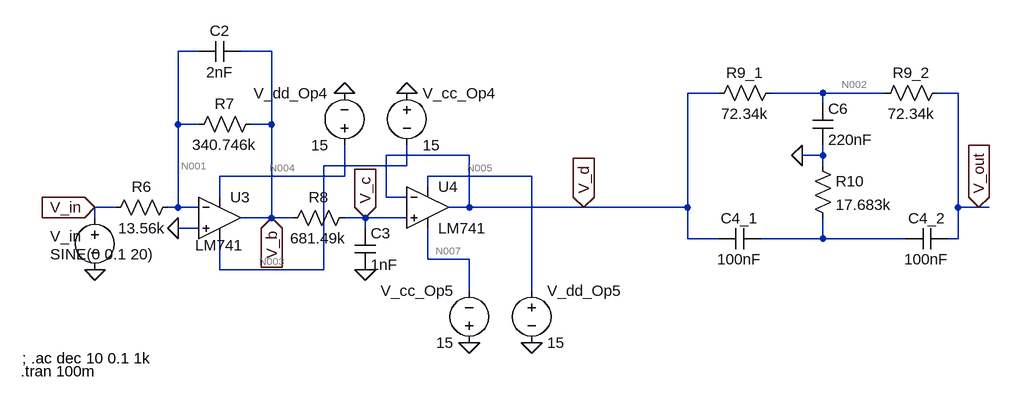
[diagram p0: schematic Experiment_1_c.asc]
Experiment_1_c.asc, the LTspice schematic file:
Version 4
SHEET 1 1132 680
WIRE -160 -48 -192 -48
WIRE -48 -48 -96 -48
WIRE 640 16 592 16
WIRE 800 16 720 16
WIRE 896 16 800 16
WIRE 1008 16 976 16
WIRE 800 32 800 16
WIRE -192 64 -192 -48
WIRE -160 64 -192 64
WIRE -48 64 -48 -48
WIRE -48 64 -80 64
WIRE 256 112 128 112
WIRE 800 112 800 96
WIRE 800 112 768 112
WIRE 160 128 160 96
WIRE 160 128 32 128
WIRE 800 128 800 112
WIRE 64 144 64 96
WIRE 64 144 -128 144
WIRE 352 144 192 144
WIRE 192 160 192 144
WIRE -128 176 -128 144
WIRE 128 176 128 112
WIRE 160 176 128 176
WIRE -288 192 -320 192
WIRE -192 192 -192 64
WIRE -192 192 -208 192
WIRE -160 192 -192 192
WIRE 256 192 256 112
WIRE 256 192 224 192
WIRE 432 192 256 192
WIRE 592 192 592 16
WIRE 592 192 432 192
WIRE 1008 192 1008 16
WIRE 1040 192 1008 192
WIRE 1056 192 1040 192
WIRE -320 208 -320 192
WIRE -48 208 -48 64
WIRE -48 208 -96 208
WIRE -16 208 -48 208
WIRE 96 208 64 208
WIRE 160 208 96 208
WIRE -160 224 -192 224
WIRE 96 224 96 208
WIRE 592 240 592 192
WIRE 640 240 592 240
WIRE 800 240 800 208
WIRE 800 240 704 240
WIRE 928 240 800 240
WIRE 1008 240 1008 192
WIRE 1008 240 992 240
WIRE 192 272 192 224
WIRE 256 272 192 272
WIRE -128 288 -128 240
WIRE 32 288 32 128
WIRE 32 288 -128 288
WIRE 256 320 256 272
WIRE 352 320 352 144
FLAG -320 288 0
FLAG -192 224 0
FLAG 64 16 0
FLAG 160 16 0
FLAG 256 400 0
FLAG 352 400 0
FLAG 96 288 0
FLAG 768 112 0
FLAG 432 192 V_d
IOPIN 432 192 In
FLAG 96 208 V_c
IOPIN 96 208 In
FLAG -48 208 V_b
IOPIN -48 208 In
FLAG -320 192 V_in
IOPIN -320 192 In
FLAG 1040 192 V_out
IOPIN 1040 192 In
SYMBOL res 80 192 R90
WINDOW 0 0 56 VBottom 2
WINDOW 3 32 56 VTop 2
SYMATTR InstName R8
SYMATTR Value 681.49k
SYMBOL cap 80 224 R0
SYMATTR InstName C3
SYMATTR Value 1nF
SYMBOL res -192 176 R90
WINDOW 0 0 56 VBottom 2
WINDOW 3 32 56 VTop 2
SYMATTR InstName R6
SYMATTR Value 13.56k
SYMBOL res -64 48 R90
WINDOW 0 0 56 VBottom 2
WINDOW 3 32 56 VTop 2
SYMATTR InstName R7
SYMATTR Value 340.746k
SYMBOL cap -96 -64 R90
WINDOW 0 0 32 VBottom 2
WINDOW 3 32 32 VTop 2
SYMATTR InstName C2
SYMATTR Value 2nF
SYMBOL voltage -320 192 R0
WINDOW 0 -69 44 Left 2
WINDOW 3 -69 72 Left 2
WINDOW 123 -69 100 Left 2
WINDOW 39 0 0 Left 0
SYMATTR InstName V_in
SYMATTR Value SINE(0 0.1 20)
SYMBOL voltage 64 112 R180
WINDOW 0 24 96 Left 2
WINDOW 3 24 16 Left 2
SYMATTR InstName V_dd_Op4
SYMATTR Value 15
SYMBOL voltage 160 0 R0
WINDOW 123 0 0 Left 0
WINDOW 39 0 0 Left 0
SYMATTR InstName V_cc_Op4
SYMATTR Value 15
SYMBOL voltage 256 416 R180
WINDOW 0 24 96 Left 2
WINDOW 3 24 16 Left 2
WINDOW 123 0 0 Left 0
WINDOW 39 0 0 Left 0
SYMATTR InstName V_cc_Op5
SYMATTR Value 15
SYMBOL voltage 352 304 R0
WINDOW 123 0 0 Left 0
WINDOW 39 0 0 Left 0
SYMATTR InstName V_dd_Op5
SYMATTR Value 15
SYMBOL res 784 112 R0
SYMATTR InstName R10
SYMATTR Value 17.683k
SYMBOL res 736 0 R90
WINDOW 0 0 56 VBottom 2
WINDOW 3 32 56 VTop 2
SYMATTR InstName R9_1
SYMATTR Value 72.34k
SYMBOL res 992 0 R90
WINDOW 0 0 56 VBottom 2
WINDOW 3 32 56 VTop 2
SYMATTR InstName R9_2
SYMATTR Value 72.34k
SYMBOL cap 784 32 R0
SYMATTR InstName C6
SYMATTR Value 220nF
SYMBOL cap 704 224 R90
WINDOW 0 0 32 VBottom 2
WINDOW 3 32 32 VTop 2
SYMATTR InstName C4_1
SYMATTR Value 100nF
SYMBOL cap 992 224 R90
WINDOW 0 0 32 VBottom 2
WINDOW 3 32 32 VTop 2
SYMATTR InstName C4_2
SYMATTR Value 100nF
SYMBOL LM741 -128 144 R0
WINDOW 3 -38 106 Left 2
SYMATTR InstName U3
SYMBOL LM741 192 128 R0
SYMATTR InstName U4
TEXT -432 424 Left 2 !; .ac dec 10 0.1 1k
TEXT -434 444 Left 2 !.tran 100m

The netlist it stands for:
* Experiment_1_c.asc
R8 V_c V_b 681.49k
C3 V_c 0 1nF
R6 N001 V_in 13.56k
R7 V_b N001 340.746k
C2 V_b N001 2nF
V_in V_in 0 SINE(0 0.1 20)
V_dd_Op4 N004 0 15
V_cc_Op4 0 N003 15
V_cc_Op5 0 N007 15
V_dd_Op5 N005 0 15
R10 0 N006 17.683k
R9_1 N002 V_d 72.34k
R9_2 V_out N002 72.34k
C6 N002 0 220nF
C4_1 N006 V_d 100nF
C4_2 V_out N006 100nF
XU3 0 N001 N004 N003 V_b LM741  ; pins In+ In- V+ V- OUT
XU4 V_c V_d N005 N007 V_d LM741  ; pins In+ In- V+ V- OUT
; .ac dec 10 0.1 1k
.tran 100m
.lib LM741.lib
.backanno
.end

* Results of the author's LTspice run, read from the files saved beside the schematic
* Operating Point, zero values left out:
*   V(v_c) = 21.4 mV
*   V(v_b) = 60.83 mV
*   V(n001) = 999.7 µV
*   V(n004) = 15 V
*   V(n003) = -15 V
*   V(n007) = -15 V
*   V(n005) = 15 V
*   V(n002) = 22.4 mV
*   V(v_d) = 22.4 mV
*   V(v_out) = 22.4 mV
*   I(R8) = -57.86 nA
*   I(R6) = 73.73 nA
*   I(R7) = 175.6 nA
*   I(V_in) = 73.73 nA
*   I(V_dd_op4) = -1.701 mA
*   I(V_cc_op4) = -1.701 mA
*   I(V_cc_op5) = -1.701 mA
*   I(V_dd_op5) = -1.701 mA
*   Ix(u3:1) = 57.86 nA
*   Ix(u3:2) = 101.9 nA
*   Ix(u3:99) = 1.701 mA
*   Ix(u3:50) = -1.701 mA
*   Ix(u3:28) = -233.4 nA
*   Ix(u4:1) = 57.86 nA
*   Ix(u4:2) = 101.9 nA
*   Ix(u4:99) = 1.701 mA
*   Ix(u4:50) = -1.701 mA
*   Ix(u4:28) = -101.9 nA
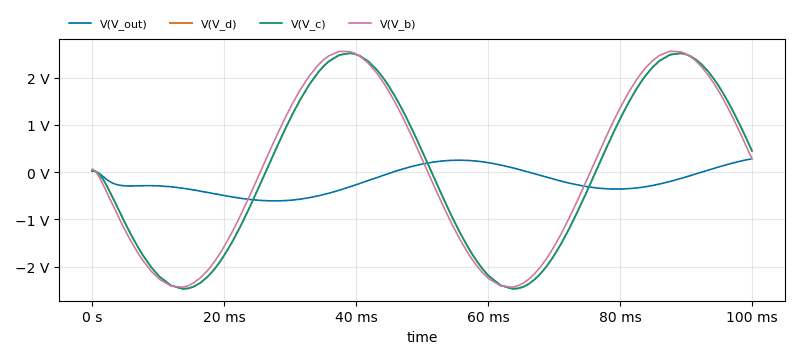
[diagram p1: Transient Analysis of Experiment_1_c.asc, plotted from the saved traces]
* Transient Analysis, 1 run:
*   V(V_out): min -610.5 mV, max 280.4 mV, average -187.3 mV, rms 322.8 mV, last 280.4 mV
*   V(V_d): min -2.471 V, max 2.516 V, average 18.05 mV, rms 1.762 V, last 448 mV
*   V(V_c): min -2.472 V, max 2.514 V, average 17.05 mV, rms 1.762 V, last 446.9 mV
*   V(V_b): min -2.437 V, max 2.557 V, average 59.37 mV, rms 1.77 V, last 275.8 mV